# Altium schematic sheet 05_DATA_IO.SchDoc
size A3
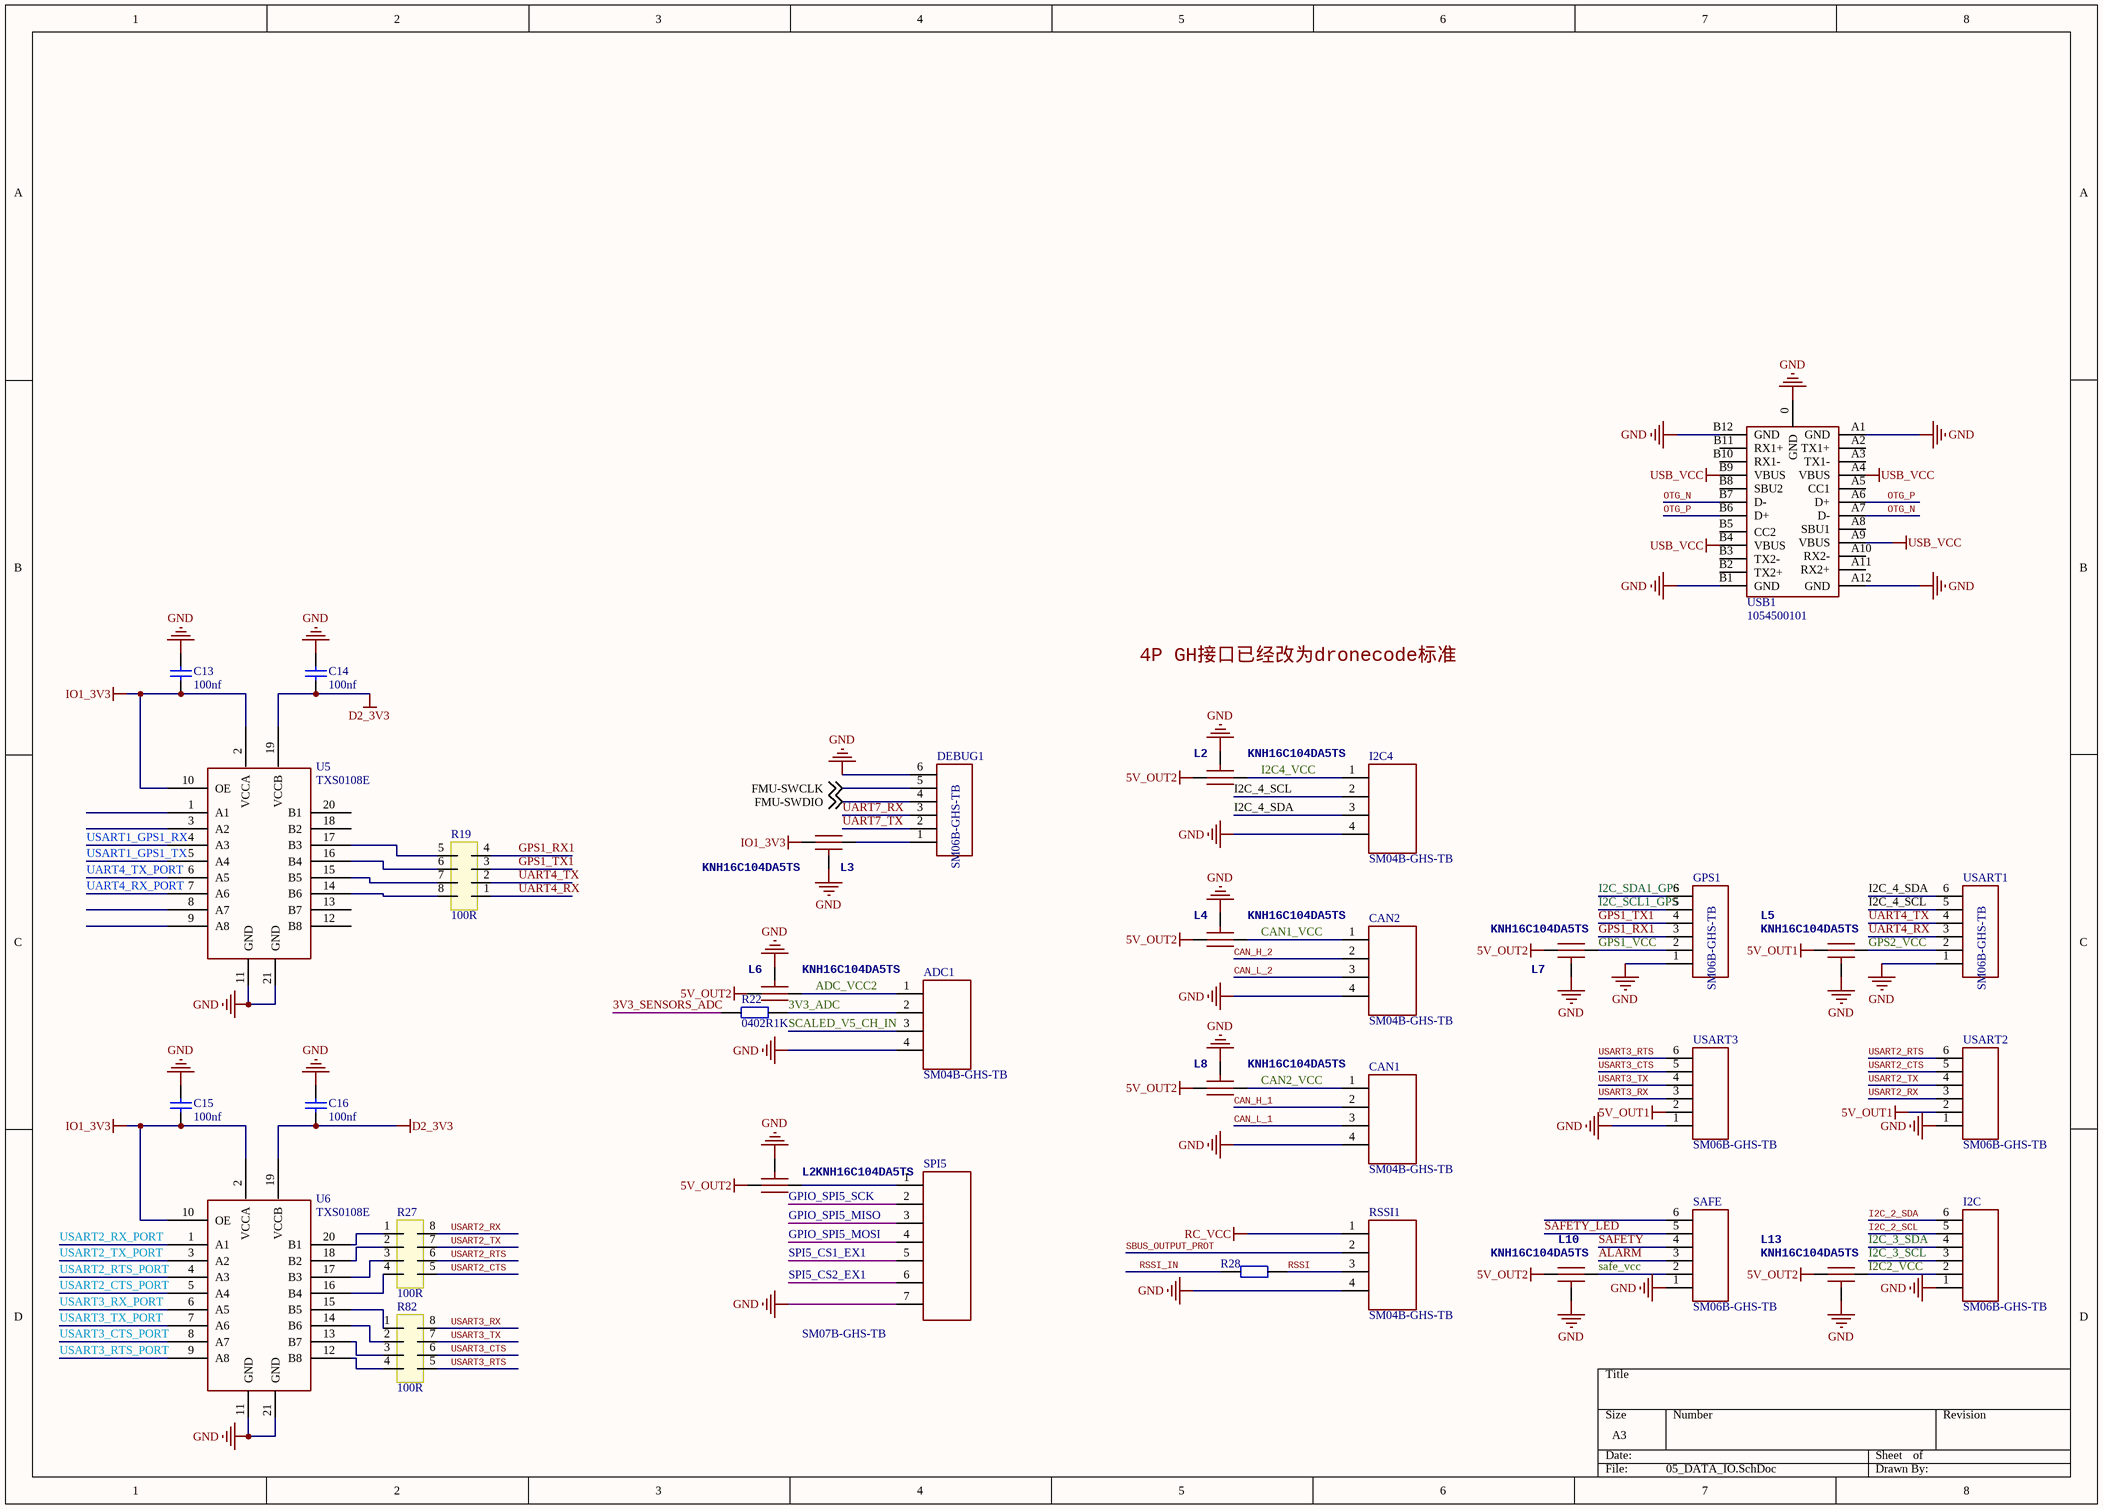
[diagram p0: 05_DATA_IO.SchDoc]

## Parts
(Parts that share a designator on the sheet are numbered #1, #2 ... from top to bottom, then left to right.)
ADC1  SM04B-GHS-TB  [BM04B-GHS_DC]
C13  100nf  [0402CAP]
C14  100nf  [0402CAP]
C15  100nf  [0402CAP]
C16  100nf  [0402CAP]
CAN1  SM04B-GHS-TB  [BM04B-GHS_DC]
CAN2  SM04B-GHS-TB  [BM04B-GHS_DC]
DEBUG1  SM06B-GHS-TB  [BM06B-GHS_DC]
GPS1  SM06B-GHS-TB  [SM06B-GHS-TB]
I2C  SM06B-GHS-TB  [SM06B-GHS-TB]
I2C4  SM04B-GHS-TB  [BM04B-GHS_DC]
L2#1  KNH16C104DA5TS  [KYOCERA-KNH16-DA]
L2#2  KNH16C104DA5TS  [KYOCERA-KNH16-DA]
L3  KNH16C104DA5TS  [KYOCERA-KNH16-DA]
L4  KNH16C104DA5TS  [KYOCERA-KNH16-DA]
L5  KNH16C104DA5TS  [KYOCERA-KNH16-DA]
L6  KNH16C104DA5TS  [KYOCERA-KNH16-DA]
L7  KNH16C104DA5TS  [KYOCERA-KNH16-DA]
L8  KNH16C104DA5TS  [KYOCERA-KNH16-DA]
L10  KNH16C104DA5TS  [KYOCERA-KNH16-DA]
L13  KNH16C104DA5TS  [KYOCERA-KNH16-DA]
R19  100R  [0402_4r]
R22  0402R1K  [0402R]
R27  100R  [0402_4r]
R28  0402R100R  [0402R]  (value not drawn)
R82  100R  [0402_4r]
RSSI1  SM04B-GHS-TB  [BM04B-GHS_DC]
SAFE  SM06B-GHS-TB  [SM06B-GHS-TB]
SPI5  SM07B-GHS-TB  [SM07B-GHS]
U5  TXS0108E  [VQFN20]
U6  TXS0108E  [VQFN20]
USART1  SM06B-GHS-TB  [SM06B-GHS-TB]
USART2  SM06B-GHS-TB  [SM06B-GHS-TB]
USART3  SM06B-GHS-TB  [SM06B-GHS-TB]
USB1  1054500101  [1054500101]

## Nets
5V_OUT1: L5.P$1 USART2.2 USART3.2
5V_OUT2: L2#1.P$2 L2#2.P$2 L4.P$2 L6.P$2 L7.P$1 L8.P$2 L10.P$1 L13.P$1
D2_3V3: C14.2 C16.2 U5.19(VCCB) U6.19(VCCB)
GND: ADC1.4 C13.1 C14.1 C15.1 C16.1 CAN1.4 CAN2.4 DEBUG1.6 GPS1.1 I2C.1 I2C4.4 L2#1.GND L2#2.GND L3.GND L4.GND L5.GND L6.GND L7.GND L8.GND L10.GND L13.GND RSSI1.4 SAFE.1 SPI5.7 U5.11(GND) U5.21(GND) U6.11(GND) U6.21(GND) USART1.1 USART2.1 USART3.1 USB1.0(GND) USB1.A1(GND) USB1.A12(GND) USB1.B1(GND) USB1.B12(GND)
IO1_3V3: C13.2 C15.2 L3.P$1 U5.2(VCCA) U5.10(OE) U6.2(VCCA) U6.10(OE)
RC_VCC: RSSI1.1
USB_VCC: USB1.A4(VBUS) USB1.A9(VBUS) USB1.B4(VBUS) USB1.B9(VBUS)
3V3_ADC: ADC1.2 R22.2
3V3_SENSORS_ADC: R22.1
ADC_VCC2: ADC1.1 L6.P$1
ALARM: SAFE.3
CAN1_VCC: CAN2.1 L4.P$1
CAN2_VCC: CAN1.1 L8.P$1
CAN_H_1: CAN1.2
CAN_H_2: CAN2.2
CAN_L_1: CAN1.3
CAN_L_2: CAN2.3
FMU-SWCLK: DEBUG1.5 ; off-sheet FMU-SWCLK
FMU-SWDIO: DEBUG1.4 ; off-sheet FMU-SWDIO
GPIO_SPI5_MISO: SPI5.3
GPIO_SPI5_MOSI: SPI5.4
GPIO_SPI5_SCK: SPI5.2
GPS1_RX1: GPS1.3 R19.4
GPS1_TX1: GPS1.4 R19.3
GPS1_VCC: GPS1.2 L7.P$2
GPS2_VCC: L5.P$2 USART1.2
I2C2_VCC: I2C.2 L13.P$2
I2C4_VCC: I2C4.1 L2#1.P$1
I2C_2_SCL: I2C.5
I2C_2_SDA: I2C.6
I2C_3_SCL: I2C.3
I2C_3_SDA: I2C.4
I2C_4_SCL: I2C4.2 USART1.5
I2C_4_SDA: I2C4.3 USART1.6
I2C_SCL1_GPS: GPS1.5
I2C_SDA1_GPS: GPS1.6
OTG_N: USB1.A7(D-) USB1.B7(D-)
OTG_P: USB1.A6(D+) USB1.B6(D+)
RSSI: R28.2 RSSI1.3
RSSI_IN: R28.1
safe_vcc: L10.P$2 SAFE.2
SAFETY: SAFE.4
SAFETY_LED: SAFE.5
SBUS_OUTPUT_PROT: RSSI1.2
SCALED_V5_CH_IN: ADC1.3
SPI5_CS1_EX1: SPI5.5
SPI5_CS2_EX1: SPI5.6
UART4_RX: R19.1 USART1.3
UART4_RX_PORT: U5.7(A6)
UART4_TX: R19.2 USART1.4
UART4_TX_PORT: U5.6(A5)
UART7_RX: DEBUG1.3
UART7_TX: DEBUG1.2
USART1_GPS1_RX: U5.4(A3)
USART1_GPS1_TX: U5.5(A4)
USART2_CTS: R27.5 USART2.5
USART2_CTS_PORT: U6.5(A4)
USART2_RTS: R27.6 USART2.6
USART2_RTS_PORT: U6.4(A3)
USART2_RX: R27.8 USART2.3
USART2_RX_PORT: U6.1(A1)
USART2_TX: R27.7 USART2.4
USART2_TX_PORT: U6.3(A2)
USART3_CTS: R82.6 USART3.5
USART3_CTS_PORT: U6.8(A7)
USART3_RTS: R82.5 USART3.6
USART3_RTS_PORT: U6.9(A8)
USART3_RX: R82.8 USART3.3
USART3_RX_PORT: U6.6(A5)
USART3_TX: R82.7 USART3.4
USART3_TX_PORT: U6.7(A6)
NetDEBUG1_1: DEBUG1.1 L3.P$2
NetL2#2_P$1: L2#2.P$1 SPI5.1
NetR19_5: R19.5 U5.17(B3)
NetR19_6: R19.6 U5.16(B4)
NetR19_7: R19.7 U5.15(B5)
NetR19_8: R19.8 U5.14(B6)
NetR27_1: R27.1 U6.20(B1)
NetR27_2: R27.2 U6.18(B2)
NetR27_3: R27.3 U6.17(B3)
NetR27_4: R27.4 U6.16(B4)
NetR82_1: R82.1 U6.15(B5)
NetR82_2: R82.2 U6.14(B6)
NetR82_3: R82.3 U6.13(B7)
NetR82_4: R82.4 U6.12(B8)

Not connected (* = marked no-connect by the designer): SAFE 6; U5 1(A1) 3(A2) 8(A7) 9(A8) 12(B8) 13(B7) 18(B2) 20(B1); USB1 A2(TX1+) A3(TX1-) A5(CC1) A8(SBU1) A10(RX2-) A11(RX2+) B2(TX2+) B3(TX2-) B5(CC2) B8(SBU2) B10(RX1-) B11(RX1+)

## Notes on the sheet
- Labels drawn without touching a wire or pin: 4P GH接口已经改为dronecode标准

## Library data of the parts
C13-C16 = Cap
CAN1 CAN2 I2C4 RSSI1 = SM04B-GHS-TB: dronecode
DEBUG1 = SM06B-GHS-TB: dronecode
L2#1 L2#2 L3-L8 L10 L13 = KNH16C104DA5TS: Capacitor, Filter, 0.1uF, 25V, 2A, 0603, SMD; 3DR_PARTNO: ECM0719; Supplier 1: Digi-Key
R19 R27 R82 = 0402-8R-4R
R22 = 0402R1K: 0402R1K 1%
R28 = 0402R100R: 0402R100R 1%